# EAGLE design soraduino_lite (EAGLE 6.2)
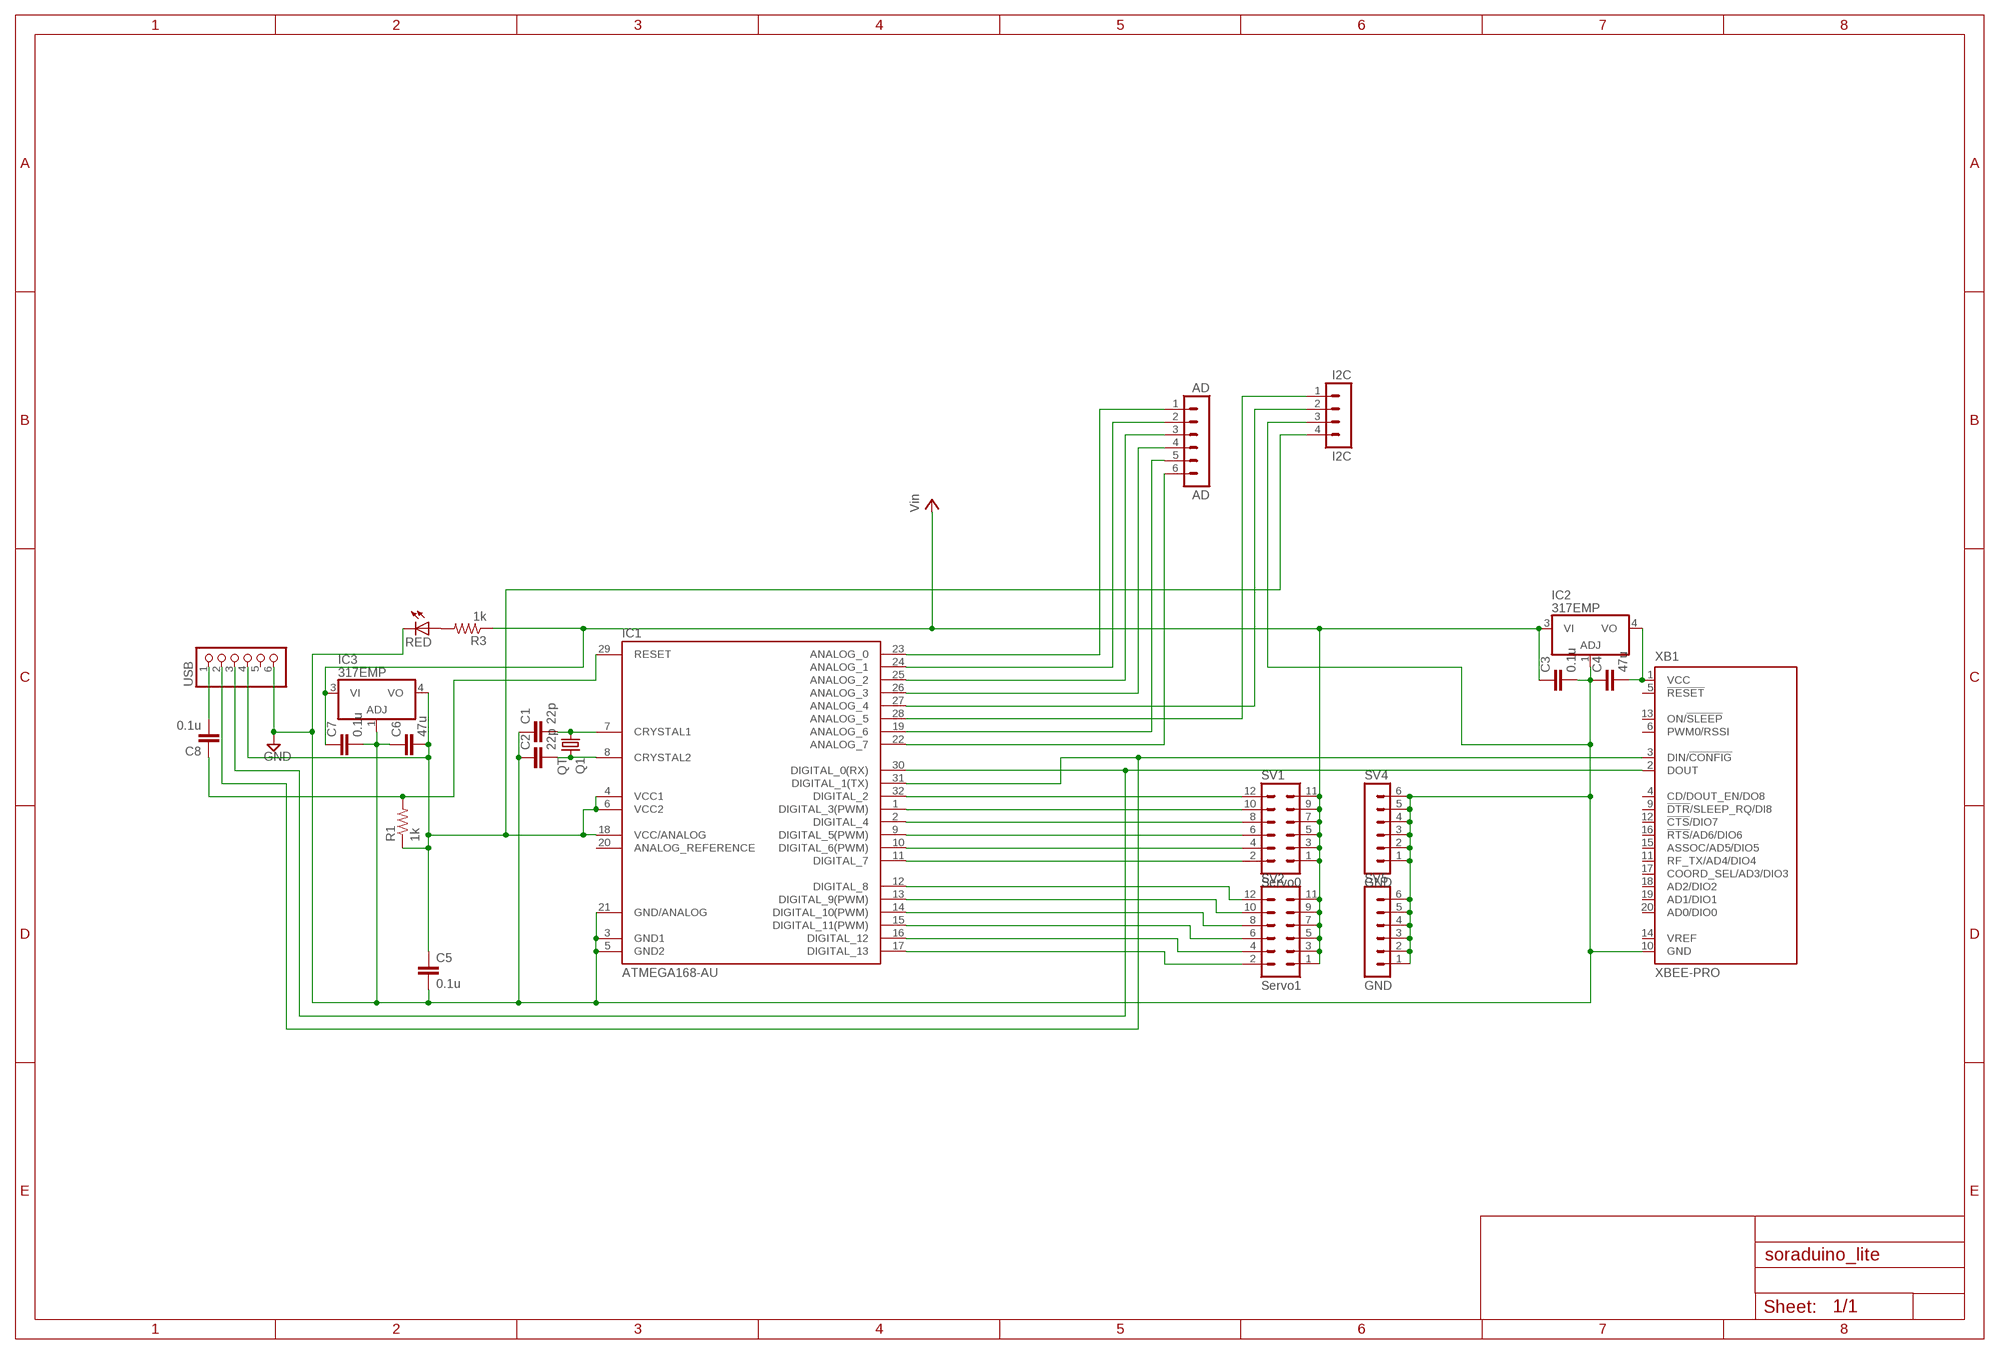
[diagram p0: schematic, sheet 1]

## Parts
AD  AD  MA06-1  [MA06-1]
C1  22p  C-EU050-024X044  [C050-024X044]
C2  22p  C-EU050-024X044  [C050-024X044]
C3  0.1u  C-EUC0805K  [C0805K]
C4  47u  C-EUC0805K  [C0805K]
C5  0.1u  C-EUC0805K  [C0805K]
C6  47u  C-EUC0805K  [C0805K]
C7  0.1u  C-EUC0805K  [C0805K]
C8  0.1u  C-EUC0805K  [C0805K]
I2C  I2C  MA04-1  [MA04-1]
IC1  ATMEGA168-AU  [TQFP32-08]
IC2  317EMP  [SOT223]
IC3  317EMP  [SOT223]
Q1  QT  CRYSTALHC49S  [HC49/S]
R1  1k  R-US_R0603  [R0603]
R3  1k  R-US_R0603  [R0603]
RED  LEDCHIPLED_1206  [CHIPLED_1206]
SV1  Servo0  MA06-2  [MA06-2]
SV2  Servo1  MA06-2  [MA06-2]
SV4  GND  MA06-1  [MA06-1]
SV5  GND  MA06-1  [MA06-1]
USB  PINHD-1X6  [1X06]
XB1  XBEE-PRO  [XBEE-PRO]

## Nets
GND: C1.1 C2.1 C3.2 C4.1 C5.2 C6.1 C7.2 I2C.3 IC1.3(GND1) IC1.5(GND2) IC1.21(GND/ANALOG) IC2.1(ADJ) IC3.1(ADJ) RED.C SV4.1 SV4.2 SV4.3 SV4.4 SV4.5 SV4.6 SV5.1 SV5.2 SV5.3 SV5.4 SV5.5 SV5.6 USB.6 XB1.10(GND)
N$1: C8.2 USB.1
N$2: C8.1 IC1.29(RESET) R1.2
N$3: IC1.30(DIGITAL_0(RX)) USB.3 XB1.2(DOUT)
N$4: C1.2 IC1.7(CRYSTAL1) Q1.1
N$5: C2.2 IC1.8(CRYSTAL2) Q1.2
N$6: C4.2 IC2.4(VO) XB1.1(VCC)
N$7: C5.1 C6.2 I2C.4 IC1.4(VCC1) IC1.6(VCC2) IC1.18(VCC/ANALOG) IC3.4(VO) R1.1 USB.4
N$8: IC1.32(DIGITAL_2) SV1.12
N$9: IC1.1(DIGITAL_3(PWM)) SV1.10
N$10: R3.2 RED.A
N$11: IC1.2(DIGITAL_4) SV1.8
N$12: IC1.9(DIGITAL_5(PWM)) SV1.6
N$13: IC1.10(DIGITAL_6(PWM)) SV1.4
N$14: IC1.11(DIGITAL_7) SV1.2
N$15: IC1.12(DIGITAL_8) SV2.12
N$16: IC1.13(DIGITAL_9(PWM)) SV2.10
N$17: IC1.14(DIGITAL_10(PWM)) SV2.8
N$18: IC1.15(DIGITAL_11(PWM)) SV2.6
N$19: IC1.16(DIGITAL_12) SV2.4
N$20: IC1.17(DIGITAL_13) SV2.2
N$21: AD.6 IC1.22(ANALOG_7)
N$22: AD.5 IC1.19(ANALOG_6)
N$23: AD.4 IC1.26(ANALOG_3)
N$24: AD.3 IC1.25(ANALOG_2)
N$25: AD.2 IC1.24(ANALOG_1)
N$26: AD.1 IC1.23(ANALOG_0)
N$31: I2C.1 IC1.28(ANALOG_5)
N$32: I2C.2 IC1.27(ANALOG_4)
N$33: IC1.31(DIGITAL_1(TX)) USB.2 XB1.3(DIN/!CONFIG)
VCC: C3.1 C7.1 IC2.3(VI) IC3.3(VI) R3.1 SV1.1 SV1.3 SV1.5 SV1.7 SV1.9 SV1.11 SV2.1 SV2.3 SV2.5 SV2.7 SV2.9 SV2.11 ; supply symbol labelled Vin
Unconnected: IC1.20(ANALOG_REFERENCE) USB.5 XB1.4(CD/DOUT_EN/DO8) XB1.5(!RESET) XB1.6(PWM0/RSSI) XB1.9(!DTR!/SLEEP_RQ/DI8) XB1.11(RF_TX/AD4/DIO4) XB1.12(!CTS!/DIO7) XB1.13(ON/!SLEEP) XB1.14(VREF) XB1.15(ASSOC/AD5/DIO5) XB1.16(!RTS!/AD6/DIO6) XB1.17(COORD_SEL/AD3/DIO3) XB1.18(AD2/DIO2) XB1.19(AD1/DIO1) XB1.20(AD0/DIO0)

## Library data of the parts
AD SV4 SV5 = con-lstb:MA06-1: PIN HEADER; OC_FARNELL: unknown; OC_NEWARK: unknown
C1 C2 = rcl:C-EU: CAPACITOR, European symbol
C3-C8 = resistor:C-EU: CAPACITOR, European symbol
I2C = con-lstb:MA04-1: PIN HEADER; OC_FARNELL: unknown; OC_NEWARK: unknown
IC1 = Arduino-AVR:ATMEGA168
IC2 IC3 = linear:*317: Positive VOLTAGE REGULATOR
Q1 = crystal:CRYSTAL: CRYSTAL; OC_FARNELL: 1667008; OC_NEWARK: unknown
R1 R3 = rcl:R-US_: RESISTOR, American symbol
RED = led:LED: LED OSRAM: - CHIPLED LG R971, LG N971, LY N971, LG Q971, LY Q971, LO R971, LY R971 LH N974, LH R974 LS Q976, LO Q976, LY Q976 LO Q996 - Hyper CHIPLED LW Q18S LB Q993, LB Q99A, LB R99A - SideLED LS A670, LO A670, LY A670, LG A670, LP A670 LB A673, LV A673, LT A673, LW A673 LH A674 LY A675 LS A676, LA A676, LO A676, LY A676, LW A676 LS A679, LY A679, LG A679 - Hyper Micro SIDELED® LS Y876, LA Y876, LO Y876, LY Y876 LT Y87S - SmartLED LW L88C, LW L88S LB L89C, LB L89S, LG L890 LS L89K, LO L89K, LY L89K LS L896, LA L896, LO L896, LY L896 - TOPLED LS T670, LO T670, LY T670, LG T670, LP T670 LSG T670, LSP T670, LSY T670, LOP T670, LYG T670 LG T671, LOG T671, LSG T671 LB T673, LV T673, LT T673, LW T673 LH T674 LS T676, LA T676, LO T676, LY T676, LB T676, LH T676, LSB T676, LW T676 LB T67C, LV T67C, LT T67C, LS T67K, LO T67K, LY T67K, LW E67C LS E67B, LA E67B, LO E67B, LY E67B, LB E67C, LV E67C, LT E67C LW T67C LS T679, LY T679, LG T679 LS T770, LO T770, LY T770, LG T770, LP T770 LB T773, LV T773, LT T773, LW T773 LH T774 LS E675, LA E675, LY E675, LS T675 LS T776, LA T776, LO T776, LY T776, LB T776 LHGB T686 LT T68C, LB T68C - Hyper Mini TOPLED® LB M676 - Mini TOPLED Santana® LG M470 LS M47K, LO M47K, LY M47K Source: http://www.osram.convergy.de LUXEON: - LUMILED® LXK2-PW12-R00, LXK2-PW12-S00, LXK2-PW14-U00, LXK2-PW14-V00 LXK2-PM12-R00, LXK2-PM12-S00, LXK2-PM14-U00 LXK2-PE12-Q00, LXK2-PE12-R00, LXK2-PE12-S00, LXK2-PE14-T00, LXK2-PE14-U00 LXK2-PB12-K00, LXK2-PB12-L00, LXK2-PB12-M00, LXK2-PB14-N00, LXK2-PB14-P00, LXK2-PB14-Q00 LXK2-PR12-L00, LXK2-PR12-M00, LXK2-PR14-Q00, LXK2-PR14-R00 LXK2-PD12-Q00, LXK2-PD12-R00, LXK2-PD12-S00 LXK2-PH12-R00, LXK2-PH12-S00 LXK2-PL12-P00, LXK2-PL12-Q00, LXK2-PL12-R00 Source: www.luxeon.com KINGBRIGHT: KA-3528ASYC Source: www.kingbright.com
SV1 SV2 = con-lstb:MA06-2: PIN HEADER; OC_FARNELL: unknown; OC_NEWARK: unknown
USB = pinhead:PINHD-1X6: PIN HEADER
XB1 = maxstream:XBEE: XBee (TM) /XBee-PRO(TM) OEM RF Modules Source: MaxStream, Inc. xbee_productmanual.pdf; MPN: XBP24-AWI-001; OC_FARNELL: 1337916; OC_NEWARK: 42M2667

## Board
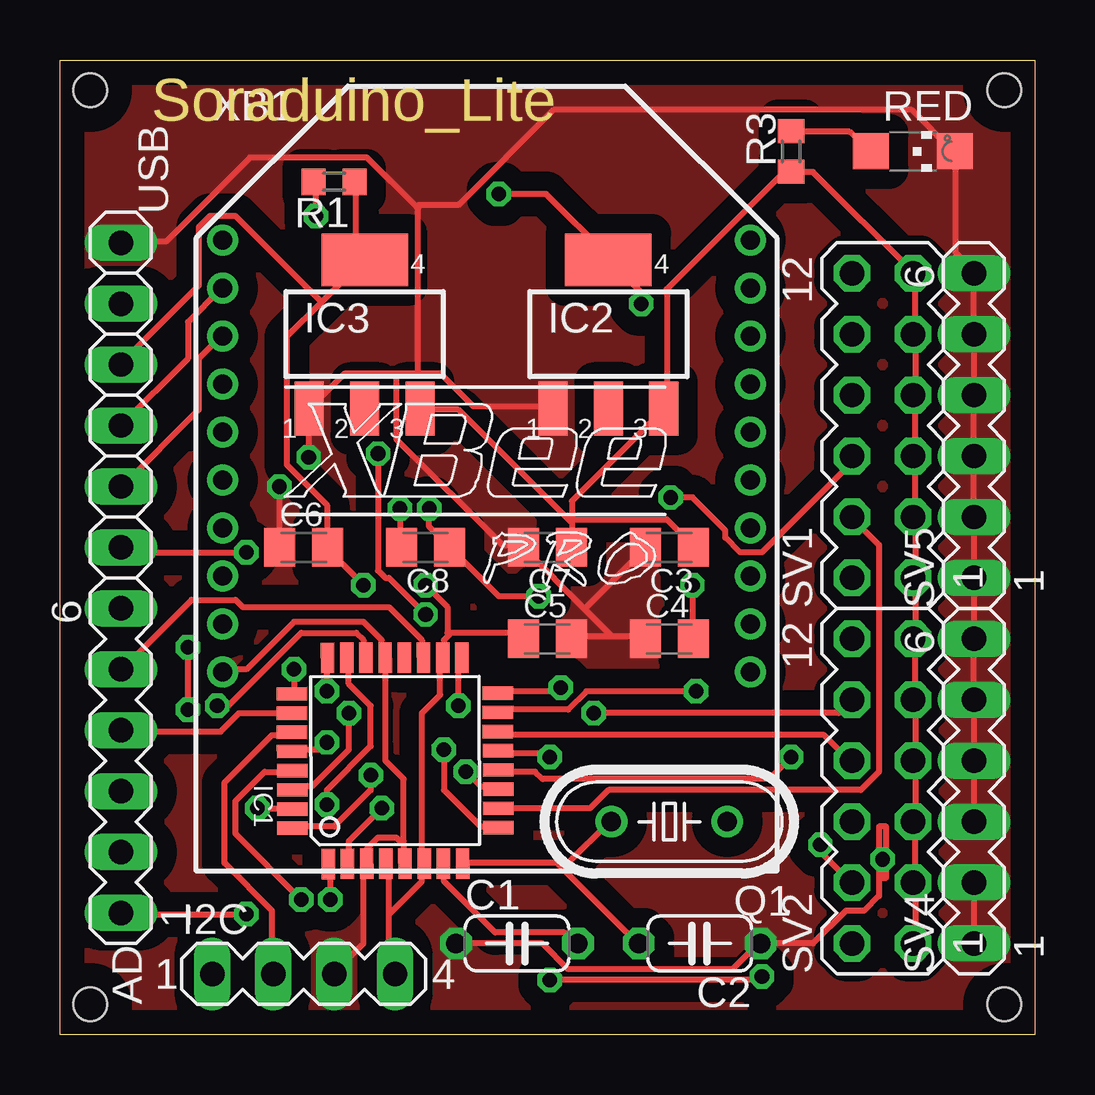
[diagram p1: board, top side]
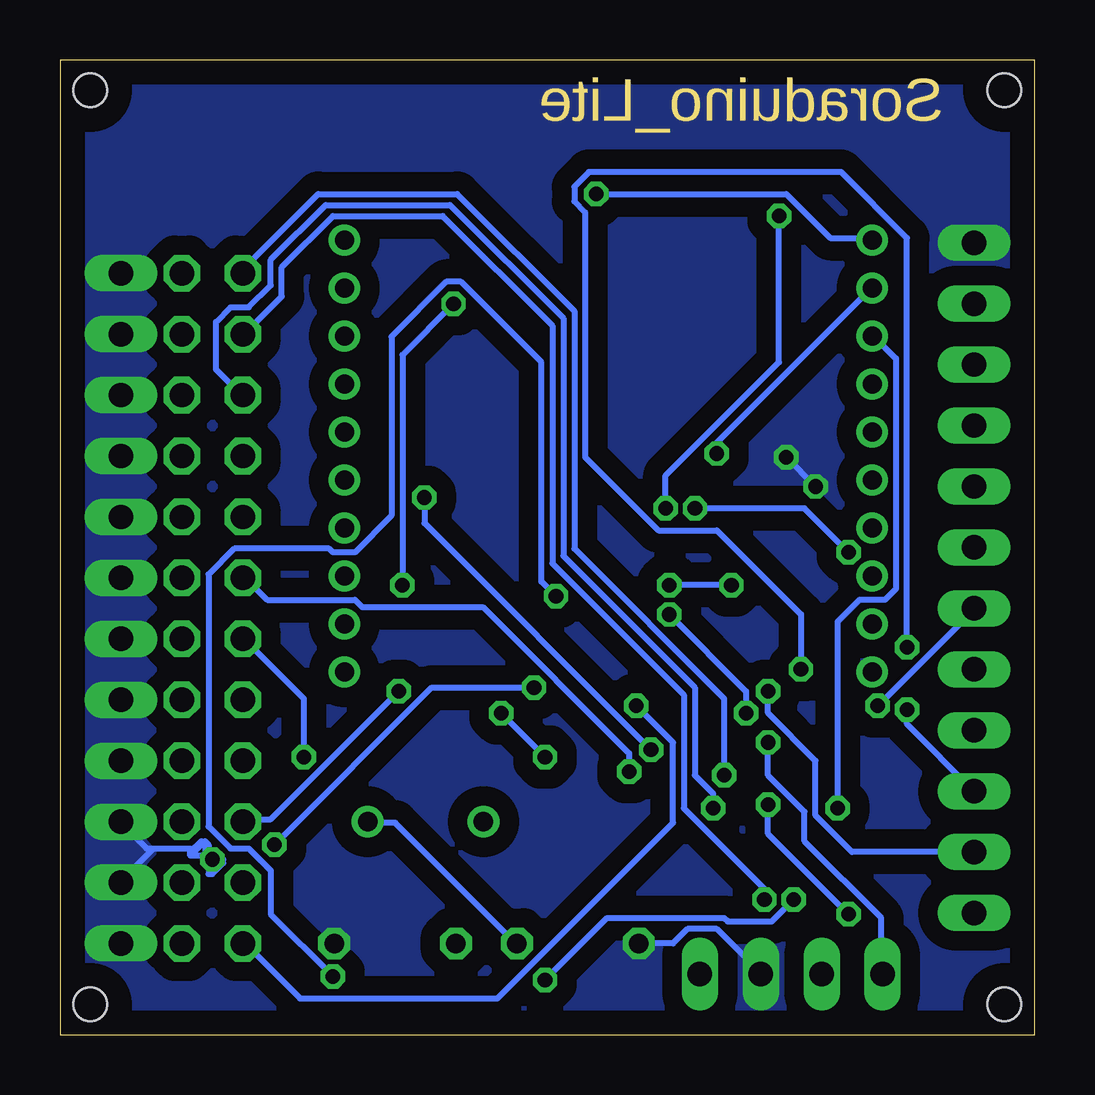
[diagram p2: board, bottom side, seen from below]

Size 40.64 x 40.64 mm. Coordinates in mm from the lower left corner, seen from the top.
Outline: 0,40.64 40.64,40.64 40.64,0 0,0 0,40.64
Copper layers (1*16): Top 0.035mm / dielectric 1.5mm / Bottom 0.035mm
Design rules: minimum track width 10mil, minimum drill 24mil, track to track 8mil, track to pad 8mil, pad to pad 8mil, via to via 8mil, smd to smd 8mil, copper to edge 40mil, drill to drill 8mil, minimum pad ring 10mil, minimum via ring 8mil, stop-mask expansion 4mil, vias tented up to drill 0mil, thermal gap 10mil
Holes 1.4 mm at 1.27,39.37 39.37,39.37 1.27,1.27 39.37,1.27

### Footprints (pad centres in the part's own frame; a part is rotated, then mirrored left to right if it is on the bottom)
MA06-1 = drill 1.016 long: 1 -6.35,0; 2 -3.81,0; 3 -1.27,0; 4 1.27,0; 5 3.81,0; 6 6.35,0
C050-024X044 = drill 0.813 octagon: 1 -2.54,0; 2 2.54,0
C0805K = smd 1.3 x 1.6: 1 -1,0; 2 1,0
MA04-1 = drill 1.016 long: 1 -3.81,0; 2 -1.27,0; 3 1.27,0; 4 3.81,0
TQFP32-08 = smd 1.27 x 0.559: 1 -4.293,2.8; 2 -4.293,2; 3 -4.293,1.2; 4 -4.293,0.4; 5 -4.293,-0.4; 6 -4.293,-1.2; 7 -4.293,-2; 8 -4.293,-2.8; 17 4.293,-2.8; 18 4.293,-2; 19 4.293,-1.2; 20 4.293,-0.4; 21 4.293,0.4; 22 4.293,1.2; 23 4.293,2; 24 4.293,2.8 | smd 0.559 x 1.27: 9 -2.8,-4.293; 10 -2,-4.293; 11 -1.2,-4.293; 12 -0.4,-4.293; 13 0.4,-4.293; 14 1.2,-4.293; 15 2,-4.293; 16 2.8,-4.293; 25 2.8,4.293; 26 2,4.293; 27 1.2,4.293; 28 0.4,4.293; 29 -0.4,4.293; 30 -1.2,4.293; 31 -2,4.293; 32 -2.8,4.293
SOT223 = smd 1.219 x 2.235: 1 -2.311,-3.099; 2 0,-3.099; 3 2.311,-3.099 | smd 3.6 x 2.2: 4 0,3.099
HC49/S = drill 0.813: 1 -2.413,0; 2 2.413,0
R0603 = smd 1 x 1.1: 1 -0.85,0; 2 0.85,0
CHIPLED_1206 = smd 1.5 x 1.5: A 0,-1.75; C 0,1.75
MA06-2 = drill 1.016 octagon: 1 -6.35,-1.27; 2 -6.35,1.27; 3 -3.81,-1.27; 4 -3.81,1.27; 5 -1.27,-1.27; 6 -1.27,1.27; 7 1.27,-1.27; 8 1.27,1.27; 9 3.81,-1.27; 10 3.81,1.27; 11 6.35,-1.27; 12 6.35,1.27
1X06 = drill 1.016 long: 1 -6.35,0; 2 -3.81,0; 3 -1.27,0; 4 1.27,0; 5 3.81,0; 6 6.35,0
XBEE-PRO = drill 0.8 pad 1.27: 1 -11,9; 2 -11,7; 3 -11,5; 4 -11,3; 5 -11,1; 6 -11,-1; 7 -11,-3; 8 -11,-5; 9 -11,-7; 10 -11,-9; 11 11,-9; 12 11,-7; 13 11,-5; 14 11,-3; 15 11,-1; 16 11,1; 17 11,3; 18 11,5; 19 11,7; 20 11,9

### Placement (x,y rotation side)
AD  2.54,11.43 90 top
C1  19.05,3.81 0 top
C2  26.67,3.81 180 top
C3  25.4,20.32 180 top
C4  25.4,16.51 0 top
C5  20.32,16.51 0 top
C6  10.16,20.32 0 top
C7  20.32,20.32 180 top
C8  15.24,20.32 180 top
I2C  10.16,2.54 0 top
IC1  13.97,11.43 90.2 top
IC2  22.86,29.21 0 top
IC3  12.7,29.21 0 top
Q1  25.4,8.89 180 top
R1  11.43,35.56 180 top
R3  30.48,36.83 90 top
RED  35.56,36.83 270 top
SV1  34.29,25.4 90 top
SV2  34.29,10.16 90 top
SV4  38.1,10.16 90 top
SV5  38.1,25.4 90 top
USB  2.54,26.67 90 top
XB1  17.78,24.13 0 top

### Tracks (layer width: path | path; a pad name or v marks a point on that pad's centre or on a via)
GND  (via drill 0.61)
  Top 0.254: 23.01,16.61 24.38,16.61 C4.1 | 23.01,16.61 21.34,16.61 C5.2 | 23.01,16.61 21.87,17.75 | 21.87,17.75 19.36,20.27 C7.2 19.2,20.42 18.44,20.42 14.02,24.84 14.02,27.58 | 21.87,17.75 24.38,20.27 C3.2 | v9.14,22.86 9.14,20.42 C6.1 | v10.36,24.08 10.36,26.06 IC3.1 10.52,26.21 11.89,27.58 14.02,27.58 | 14.02,27.58 14.94,27.58 | 14.94,27.58 15.85,27.58 17.22,26.21 20.42,26.21 IC2.1 | 14.86,34.52 14.94,34.44 14.94,27.58 | 14.86,34.52 12.8,36.58 7.92,36.58 4.42,33.07 2.59,33.07 USB.6 | XB1.10 6.86,15.24 7.77,15.24 9.75,17.22 12.65,17.22 13.41,16.46 13.41,15.85 IC1.21 13.56,15.7 13.56,11.43 14.33,10.67 14.33,8.08 14.25,8 | I2C.3 11.43,2.59 12.65,3.81 12.65,7.01 IC1.3 12.8,7.16 12.8,7.77 13.26,8.23 14.02,8.23 14.25,8 | 14.25,8 14.33,7.92 14.33,7.16 IC1.5 | SV4.2 SV4.1 | v34.29,7.32 34.29,6.55 34.44,6.55 34.44,8.69 34.14,8.69 34.14,5.79 33.53,5.18 32.77,5.18 31.39,3.81 C2.1 29.11,3.81 28.04,2.74 21.18,2.74 20.12,3.81 C1.1 | SV4.3 SV4.4 SV4.5 SV4.6 SV5.1 SV5.2 SV5.3 SV5.4 SV5.5 SV5.6 38.1,31.85 37.34,32.61 37.34,36.73 RED.C 37.19,36.88 35.51,38.56 20.57,38.56 16.61,34.59 14.94,34.59 14.86,34.52
  Bottom 0.254: v10.36,24.08 v9.14,22.86 | C1.1 15.09,3.81 14.48,4.42 13.26,4.42 11.43,2.59 I2C.3 | v34.29,7.32 33.83,7.32 33.83,7.16 34.29,6.71 34.44,6.71 34.44,7.92 34.59,8.08 34.75,8.08 35.2,7.62 35.2,7.47 34.59,7.47 34.59,7.92 34.75,7.92 35.05,7.62 35.2,7.77 36.73,7.77 | 36.73,7.77 37.03,7.77 38.1,8.84 SV4.3 | 36.73,7.77 38.1,6.4 SV4.2
  pour Top (isolate 0.813, no thermals): 0,40.64 40.64,40.64 40.64,0 0,0
  pour Bottom (isolate 0.813, no thermals): 0,40.64 40.64,40.64 40.64,0 0,0
N$1  (via drill 0.61)
  Top 0.254: v14.17,21.95 14.17,20.42 C8.2 | v7.77,20.12 2.74,20.12 USB.1
  Bottom 0.254: v14.17,21.95 9.6,21.95 v7.77,20.12
N$2  (via drill 0.61)
  Top 0.254: v10.67,34.14 10.67,35.51 R1.2 | v15.39,21.95 15.39,21.18 16.15,20.42 C8.1 16.31,20.27 18.29,18.29 v19.96,18.29 | v10.06,5.64 7.32,8.38 7.32,9.75 8.53,10.97 9.6,10.97 IC1.29 | v20.42,2.29 29.11,2.29 v29.26,2.44
  Bottom 0.254: v10.67,34.14 10.67,28.04 15.39,23.32 v15.39,21.95 | v10.06,5.64 10.97,4.72 12.8,4.72 12.95,4.88 17.83,4.88 v20.42,2.29 | v29.26,2.44 31.85,5.03 31.85,6.86 32.77,7.77 33.53,7.77 34.44,8.69 34.44,19.2 33.38,20.27 29.41,20.27 29.26,20.12 28.35,20.12 26.82,21.64 26.82,29.11 24.54,31.39 23.93,31.39 20.57,28.04 20.57,18.9 v19.96,18.29
N$3  (via drill 0.61)
  Top 0.254: v12.04,13.41 12.04,11.89 10.52,10.36 9.75,10.36 IC1.30 | v15.24,17.53 13.72,19.05 13.56,19.05 13.26,19.36 v13.26,24.23 | USB.3 5.33,28.19 5.33,29.72 6.71,31.09 XB1.2
  Bottom 0.254: v12.04,13.41 12.04,14.33 v15.24,17.53 | v13.26,24.23 13.26,24.69 6.86,31.09 XB1.2
N$4
  Top 0.254: IC1.7 16,7.01 16,6.4 18.14,4.27 21.03,4.27 21.49,3.81 C1.2
  Bottom 0.254: Q1.1 27.74,8.84 26.67,8.84 21.64,3.81 C1.2
N$5
  Top 0.254: 20.73,7.16 21.18,7.16 22.86,8.84 Q1.2 | 20.73,7.16 16.92,7.16 IC1.8 | 20.73,7.16 24.08,3.81 C2.2
N$6  (via drill 0.61)
  Top 0.254: v26.36,18.75 26.36,16.61 C4.2 | v24.23,30.48 24.23,30.94 IC2.4 | IC2.4 | v18.29,35.05 20.27,35.05 22.86,32.46 IC2.4
  Bottom 0.254: v26.36,18.75 26.36,28.35 v24.23,30.48 | v18.29,35.05 10.36,35.05 8.53,33.22 6.86,33.22 XB1.1
N$7  (via drill 0.61)
  Top 0.254: 16.23,16.69 16.31,16.76 19.05,16.76 19.2,16.61 C5.1 | 16.23,16.69 16,16.46 16,15.85 IC1.18 15.85,15.7 15.85,14.17 15.09,13.41 15.09,7.16 IC1.6 15.09,7.01 15.09,6.4 13.72,5.03 | 13.72,5.03 13.72,2.74 13.87,2.59 I2C.4 | 13.72,5.03 13.72,7.01 IC1.4 | R1.1 12.34,35.51 12.34,32.77 12.65,32.46 IC3.4 12.65,32.31 10.9,30.56 | 10.9,30.56 9.45,29.11 9.45,23.77 11.12,22.1 11.12,20.42 C6.2 11.12,20.27 v12.65,18.75 | 10.9,30.56 7.32,34.14 6.25,34.14 5.79,33.68 5.79,31.24 2.59,28.04 USB.4 | v15.24,18.75 16.15,17.83 16.15,16.76 16.23,16.69
  Bottom 0.254: v12.65,18.75 v15.24,18.75
N$8  (via drill 0.61)
  Top 0.254: v12.95,10.82 12.95,10.21 11.43,8.69 9.75,8.69 IC1.32
  Bottom 0.254: v12.95,10.82 12.95,14.02 19.2,20.27 19.2,30.18 24.08,35.05 29.87,35.05 33.07,31.85 SV1.12
N$9  (via drill 0.61)
  Top 0.254: v11.28,5.64 11.28,7.01 IC1.1
  Bottom 0.254: v11.28,5.64 11.28,6.1 14.63,9.45 14.63,14.17 20.12,19.66 20.12,29.57 24.69,34.14 29.26,34.14 31.39,32 31.39,30.79 32.92,29.26 SV1.10
N$10
  Top 0.254: R3.2 30.48,37.64 32.92,37.64 33.68,36.88 RED.A
N$11  (via drill 0.61)
  Top 0.254: v13.41,9.45 12.04,8.08 12.04,7.16 IC1.2
  Bottom 0.254: v13.41,9.45 13.41,10.06 14.17,10.82 14.17,14.48 19.66,19.96 19.66,29.87 24.38,34.59 29.57,34.59 31.85,32.31 31.85,31.24 32.77,30.33 33.53,30.33 34.14,29.72 34.14,27.74 33.07,26.67 SV1.8
N$12  (via drill 0.61)
  Top 0.254: v16,11.89 16,10.21 17.53,8.69 18.14,8.69 IC1.9 | v25.45,22.4 26.36,22.4 27.74,21.03 27.74,20.73 28.35,20.12 29.26,20.12 32.92,23.77 32.92,24.08 SV1.6
  Bottom 0.254: v16,11.89 25.45,21.34 v25.45,22.4
N$13
  Top 0.254: IC1.10 18.29,9.45 22.1,9.45 22.86,10.21 33.38,10.21 34.14,10.97 34.14,20.42 33.07,21.49 SV1.4
N$14  (via drill 0.61)
  Top 0.254: v16.92,10.97 17.53,10.36 18.14,10.36 IC1.11
  Bottom 0.254: v16.92,10.97 16.92,11.73 23.01,17.83 28.04,17.83 28.35,18.14 32,18.14 32.92,19.05 SV1.2
N$15  (via drill 0.61)
  Top 0.254: v30.48,11.58 29.57,10.67 20.12,10.67 19.81,10.97 18.29,10.97 IC1.12
  Bottom 0.254: v30.48,11.58 30.48,14.02 32.92,16.46 SV2.12
N$16  (via drill 0.61)
  Top 0.254: v20.42,11.58 20.27,11.73 18.29,11.73 IC1.13 | v22.25,13.41 32.46,13.41 SV2.10
  Bottom 0.254: v22.25,13.41 v20.42,11.58
N$17
  Top 0.254: IC1.14 18.29,12.5 31.85,12.5 32.92,11.43 SV2.8
N$18  (via drill 0.61)
  Top 0.254: v26.52,14.33 21.95,14.33 21.18,13.56 18.29,13.56 IC1.15
  Bottom 0.254: v26.52,14.33 31.85,8.99 32.92,8.99 SV2.6
N$19  (via drill 0.61)
  Top 0.254: v20.88,14.48 20.73,14.33 18.29,14.33 IC1.16 | v31.7,7.92 31.7,7.62 32.92,6.4 SV2.4
  Bottom 0.254: v20.88,14.48 25.15,14.48 v31.7,7.92
N$20  (via drill 0.61)
  Top 0.254: v16.61,13.72 16.61,15.7 IC1.17
  Bottom 0.254: v16.61,13.72 15.09,12.19 15.09,8.84 22.4,1.52 30.63,1.52 32.92,3.81 SV2.2
N$21  (via drill 0.61)
  Top 0.254: v6.55,13.72 7.01,13.72 10.06,16.76 12.34,16.76 12.65,16.46 12.65,15.85 IC1.22
  Bottom 0.254: v6.55,13.72 2.59,17.68 AD.6
N$22
  Top 0.254: IC1.19 15.09,15.85 15.09,16.46 13.72,17.83 7.62,17.83 7.32,18.14 5.49,18.14 2.59,15.24 AD.5
N$23
  Top 0.254: IC1.26 9.6,13.41 7.47,13.41 6.71,12.65 2.59,12.65 AD.4
N$24  (via drill 0.61)
  Top 0.254: v9.75,15.24 9.75,14.33 IC1.25 | v5.33,13.56 v5.33,16.15
  Bottom 0.254: v9.75,15.24 9.75,17.53 13.26,21.03 15.7,21.03 18.75,24.08 18.75,34.29 19.2,34.75 19.2,35.36 18.59,35.97 8.08,35.97 5.33,33.22 v5.33,16.15 | v5.33,13.56 5.33,12.95 AD.3
N$25  (via drill 0.61)
  Top 0.254: v11.12,14.33 11.12,15.7 IC1.24
  Bottom 0.254: v11.12,14.33 11.12,13.41 9.14,11.43 9.14,9.14 7.62,7.62 AD.2
N$26  (via drill 0.61)
  Top 0.254: v11.12,9.6 11.12,10.21 12.95,12.04 12.95,13.72 12.04,14.63 12.04,15.7 IC1.23 | v7.77,5.03 2.59,5.03 AD.1
  Bottom 0.254: v11.12,9.6 11.12,8.38 v7.77,5.03
N$31  (via drill 0.61)
  Top 0.254: v11.12,12.19 10.82,11.89 9.75,11.89 IC1.28
  Bottom 0.254: v11.12,12.19 11.12,10.82 9.6,9.3 9.6,8.08 6.4,4.88 6.4,2.59 I2C.1
N$32
  Top 0.254: IC1.27 9.6,12.5 8.84,12.5 6.86,10.52 6.86,7.16 8.84,5.18 8.84,2.59 I2C.2
N$33  (via drill 0.61)
  Top 0.254: v8.23,9.45 9.6,9.45 IC1.31 | USB.2 2.59,22.86 5.79,26.06 5.79,28.19 6.71,29.11 XB1.3
  Bottom 0.254: v8.23,9.45 8.23,17.22 7.32,18.14 6.25,18.14 5.79,18.59 5.79,28.19 6.71,29.11 XB1.3
VCC
  Top 0.254: 21.34,21.49 21.34,22.25 25.15,26.06 IC2.3 25.3,26.21 25.3,31.09 30.18,35.97 30.48,35.97 | 21.34,21.49 21.34,21.34 | 21.34,21.34 21.34,20.42 C7.1 | 21.34,21.49 25.3,21.49 26.36,20.42 C3.1 | 21.34,21.34 16.61,26.06 15.09,26.06 IC3.3 | SV2.1 35.66,3.81 35.66,6.25 SV2.3 35.66,6.4 35.66,8.84 SV2.5 35.66,8.99 35.66,11.43 | 35.66,11.43 35.66,13.87 SV2.9 35.66,14.02 35.66,16.46 SV2.11 35.66,16.61 35.66,19.05 | 35.66,11.43 SV2.7 | 30.48,35.97 31.39,35.97 35.51,31.85 SV1.11 35.66,31.7 35.66,29.26 SV1.9 35.66,29.11 35.66,26.67 | 35.66,19.05 35.66,21.49 SV1.3 35.66,21.64 35.66,24.08 SV1.5 35.66,24.23 35.66,26.67 | 35.66,26.67 SV1.7 | 35.66,19.05 SV1.1 | 30.48,35.97 R3.1

### Text on the board
Dimension: Soraduino_Lite